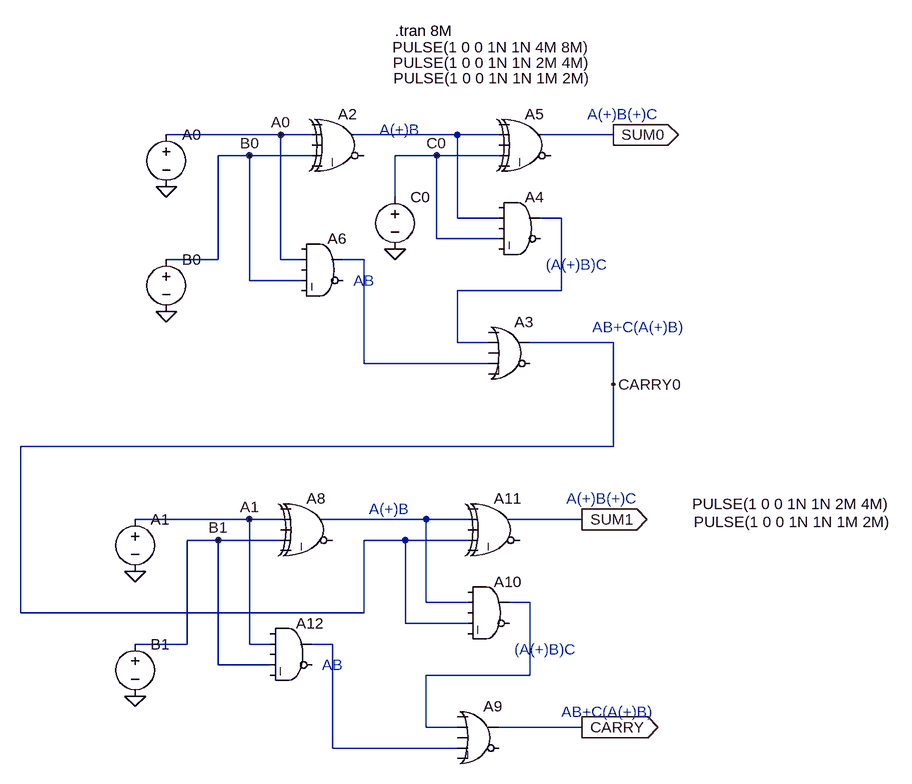
[diagram p0: schematic 2-bit full adder.asc]
2-bit full adder.asc, the LTspice schematic file:
Version 4
SHEET 1 940 1032
WIRE -48 48 -224 48
WIRE 0 48 -48 48
WIRE 224 48 64 48
WIRE 288 48 224 48
WIRE 464 48 352 48
WIRE -96 80 -144 80
WIRE 0 80 -96 80
WIRE 192 80 128 80
WIRE 288 80 192 80
WIRE 128 144 128 80
WIRE 224 176 224 48
WIRE 288 176 224 176
WIRE 384 176 352 176
WIRE 192 208 192 80
WIRE 288 208 192 208
WIRE -144 240 -144 80
WIRE -144 240 -224 240
WIRE -48 240 -48 48
WIRE -16 240 -48 240
WIRE 80 240 48 240
WIRE -96 272 -96 80
WIRE -16 272 -96 272
WIRE 384 288 384 176
WIRE 384 288 224 288
WIRE 224 368 224 288
WIRE 272 368 224 368
WIRE 464 368 336 368
WIRE 80 400 80 240
WIRE 272 400 80 400
WIRE 464 432 464 368
WIRE 464 528 464 432
WIRE 464 528 -448 528
WIRE -96 640 -272 640
WIRE -48 640 -96 640
WIRE 176 640 16 640
WIRE 240 640 176 640
WIRE 416 640 304 640
WIRE -144 672 -192 672
WIRE -48 672 -144 672
WIRE 144 672 80 672
WIRE 240 672 144 672
WIRE 176 768 176 640
WIRE 240 768 176 768
WIRE 336 768 304 768
WIRE -448 784 -448 528
WIRE 80 784 80 672
WIRE 80 784 -448 784
WIRE 144 800 144 672
WIRE 240 800 144 800
WIRE -192 832 -192 672
WIRE -192 832 -272 832
WIRE -96 832 -96 640
WIRE -64 832 -96 832
WIRE 32 832 0 832
WIRE -144 864 -144 672
WIRE -64 864 -144 864
WIRE 336 880 336 768
WIRE 336 880 176 880
WIRE 176 960 176 880
WIRE 224 960 176 960
WIRE 416 960 288 960
WIRE 32 992 32 832
WIRE 224 992 32 992
FLAG -224 128 0
FLAG -224 320 0
FLAG 128 224 0
FLAG 464 48 SUM0
IOPIN 464 48 Out
FLAG -272 720 0
FLAG -272 912 0
FLAG 416 640 SUM1
IOPIN 416 640 Out
FLAG 416 960 CARRY
IOPIN 416 960 Out
FLAG -48 48 A0
FLAG -96 80 B0
FLAG -96 640 A1
FLAG -144 672 B1
FLAG 464 432 CARRY0
FLAG 192 80 C0
SYMBOL voltage -224 32 R0
WINDOW 3 348 -119 Left 2
WINDOW 123 0 0 Left 0
WINDOW 39 0 0 Left 0
SYMATTR Value PULSE(1 0 0 1N 1N 4M 8M)
SYMATTR InstName A0
SYMBOL voltage -224 224 R0
WINDOW 3 349 -287 Left 2
WINDOW 123 0 0 Left 0
WINDOW 39 0 0 Left 0
SYMATTR Value PULSE(1 0 0 1N 1N 2M 4M)
SYMATTR InstName B0
SYMBOL voltage 128 128 R0
WINDOW 3 -2 -167 Left 2
WINDOW 123 0 0 Left 0
WINDOW 39 0 0 Left 0
SYMATTR Value PULSE(1 0 0 1N 1N 1M 2M)
SYMATTR InstName C0
SYMBOL Digital\\xor 48 0 R0
SYMATTR InstName A2
SYMBOL Digital\\or 304 320 R0
SYMATTR InstName A3
SYMBOL Digital\\and 320 128 R0
SYMATTR InstName A4
SYMBOL Digital\\xor 336 0 R0
SYMATTR InstName A5
SYMBOL Digital\\and 16 192 R0
SYMATTR InstName A6
SYMBOL voltage -272 624 R0
WINDOW 3 858 -8 Left 2
WINDOW 123 0 0 Left 0
WINDOW 39 0 0 Left 0
SYMATTR Value PULSE(1 0 0 1N 1N 2M 4M)
SYMATTR InstName A1
SYMBOL voltage -272 816 R0
WINDOW 3 860 -172 Left 2
WINDOW 123 0 0 Left 0
WINDOW 39 0 0 Left 0
SYMATTR Value PULSE(1 0 0 1N 1N 1M 2M)
SYMATTR InstName B1
SYMBOL Digital\\xor 0 592 R0
SYMATTR InstName A8
SYMBOL Digital\\or 256 912 R0
SYMATTR InstName A9
SYMBOL Digital\\and 272 720 R0
SYMATTR InstName A10
SYMBOL Digital\\xor 288 592 R0
SYMATTR InstName A11
SYMBOL Digital\\and -32 784 R0
SYMATTR InstName A12
TEXT 128 -112 Left 2 !.tran 8M
TEXT 104 40 Left 2 ;A(+)B
TEXT 424 16 Left 2 ;A(+)B(+)C
TEXT 64 272 Left 2 ;AB
TEXT 360 248 Left 2 ;(A(+)B)C
TEXT 432 344 Left 2 ;AB+C(A(+)B)
TEXT 88 624 Left 2 ;A(+)B
TEXT 392 608 Left 2 ;A(+)B(+)C
TEXT 16 864 Left 2 ;AB
TEXT 312 840 Left 2 ;(A(+)B)C
TEXT 384 936 Left 2 ;AB+C(A(+)B)

The netlist it stands for:
* 2-bit full adder.asc
V§A0 A0 0 PULSE(1 0 0 1N 1N 4M 8M)
V§B0 B0 0 PULSE(1 0 0 1N 1N 2M 4M)
V§C0 C0 0 PULSE(1 0 0 1N 1N 1M 2M)
A2 0 A0 0 B0 0 0 N001 0 XOR
A3 0 N002 0 N003 0 0 CARRY0 0 OR
A4 0 N001 0 C0 0 0 N002 0 AND
A5 0 N001 0 C0 0 0 SUM0 0 XOR
A6 0 A0 0 B0 0 0 N003 0 AND
V§A1 A1 0 PULSE(1 0 0 1N 1N 2M 4M)
V§B1 B1 0 PULSE(1 0 0 1N 1N 1M 2M)
A8 0 A1 0 B1 0 0 N004 0 XOR
A9 0 N005 0 N006 0 0 CARRY 0 OR
A10 0 N004 0 CARRY0 0 0 N005 0 AND
A11 0 N004 0 CARRY0 0 0 SUM1 0 XOR
A12 0 A1 0 B1 0 0 N006 0 AND
.tran 8M
* A(+)B
* A(+)B(+)C
* AB
* (A(+)B)C
* AB+C(A(+)B)
* A(+)B
* A(+)B(+)C
* AB
* (A(+)B)C
* AB+C(A(+)B)
.backanno
.end

* Results of the author's LTspice run, read from the files saved beside the schematic
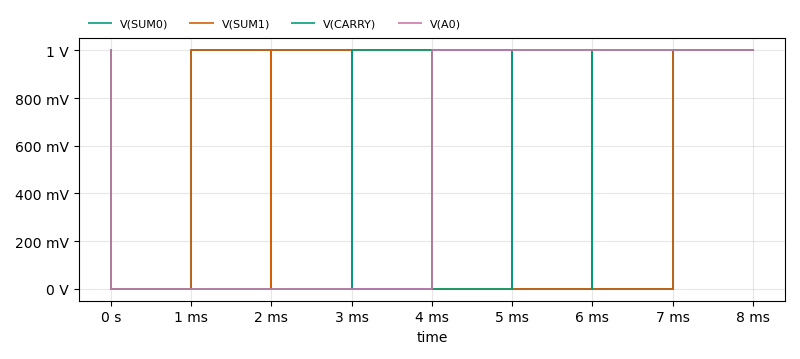
[diagram p1: Transient Analysis of 2-bit full adder.asc, plotted from the saved traces]
* Transient Analysis, 1 run:
*   V(SUM0): min 0 V, max 1 V, average 500 mV, rms 707.1 mV, last 1 V
*   V(SUM1): min 0 V, max 1 V, average 500 mV, rms 707.1 mV, last 1 V
*   V(CARRY): min 0 V, max 1 V, average 500 mV, rms 707.1 mV, last 1 V
*   V(A0): min 0 V, max 1 V, average 500 mV, rms 707.1 mV, last 1 V